# Altium project electrilLoad.PrjPcb
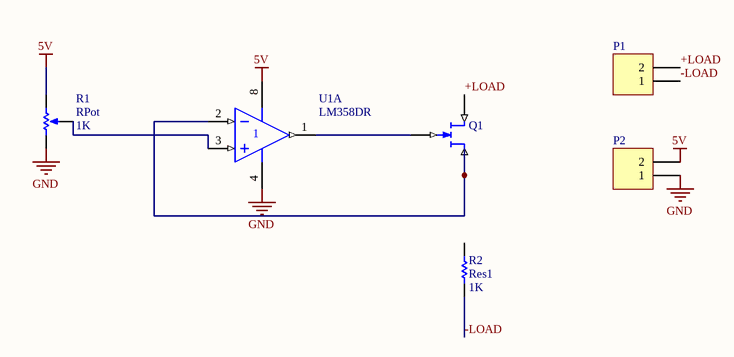
[diagram p0: Sheet2.SchDoc]
1 sheet, 6 parts. Net scope: global (net labels, ports and power ports of the same name join across sheets).
Board file: PCB1.PcbDoc

## Sheet Sheet2.SchDoc
size A4

### Parts
P1  Header 2  [HDR1X2]  (value not drawn)
P2  Header 2  [HDR1X2]  (value not drawn)
Q1  MESFET-N  [DPAK228P962X230-3N]  (value not drawn)
R1  RPot  value 1K  [Rm065-v1]
R2  Res1  value 1K  [AXIAL-0.3]
U1  LM358DR  [D008_L]  (part A of 2)

### Nets
5V: P2.2 R1.2(BOT) U1.8(V+)
GND: P2.1 R1.1(TOP) U1.4(V-)
+LOAD: P1.2 Q1.2(D)
-LOAD: P1.1 R2.1
NetQ1_1: Q1.1(G) U1.1(OUT)
NetQ1_3: Q1.3(S) U1.2(IN-)
NetR1_3: R1.3(TAP) U1.3(IN+)

Not connected (* = marked no-connect by the designer): R2 2

### Library data of the parts
P1 P2 = Header 2: Header, 2-Pin; LatestRevisionDate: 17-Jul-2002; LatestRevisionNote: Re-released for DXP Platform.; Publisher: Altium Limited
Q1 = MESFET-N: N-Channel MESFET; Published: 8-Jun-2000; LatestRevisionDate: 17-Jul-2002; LatestRevisionNote: Re-released for DXP Platform.; PackageReference: TO-18; Publisher: Altium Limited; PackageDescription: Can; 3 Leads; Pin Circle Dia. 2.54 mm; Lead Dia. 0.48 mm (max); Code_JEDEC: TO-18
R1 = RPot: Potentiometer; Sim Note: Enter the Resistance value and the set point into parameter fields.; Set Position: 0.5; Published: 8-Jun-2000; LatestRevisionDate: 17-Jul-2002; LatestRevisionNote: Re-released for DXP Platform.; PackageReference: VR5; Publisher: Altium Limited; PackageDescription: Variable Resistor, Thru-Hole; 3 Leads
R2 = Res1: Resistor; Published: 8-Jun-2000; LatestRevisionDate: 17-Jul-2002; LatestRevisionNote: Re-released for DXP Platform.; PackageReference: AXIAL-0.3; Publisher: Altium Limited; PackageDescription: Axial Device, Thru-Hole; 2 Leads; 0.3 in Pin Spacing
U1 = LM358DR: Dual Operational Amplifier; Published: 15-Apr-2002; LatestRevisionDate: 13-Apr-2006; LatestRevisionNote: IPC-7351 Footprint Added.; DatasheetVersion: Aug-1988; PackageVersion: Jan-1998; PackageReference: D008; Publisher: Altium Limited; PackageDescription: 8-Pin Small Outline Integrated Circuit 1.27 mm Pitch; Code_IPC: SOIC127P600-8; ComponentLink1Description: Manufacturer Link; ComponentLink1URL: http://www.ti.com/; ComponentLink2Description: Datasheet; ComponentLink2URL: http://www-s.ti.com/sc/ds/lm358.pdf